# EAGLE design mpx (EAGLE 8.2.1)
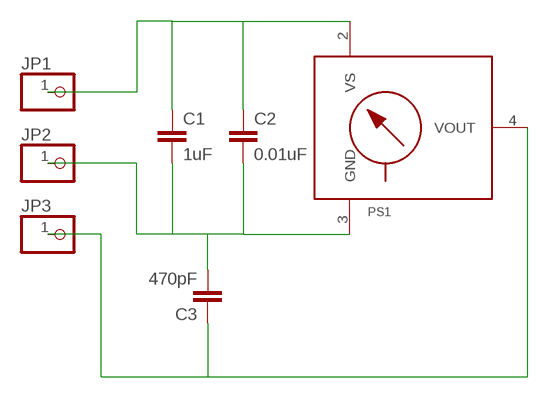
[diagram p0: schematic, sheet 1]

## Parts
C1  1uF  C-EU050-024X044  [C050-024X044]
C2  0.01uF  C-EU050-024X044  [C050-024X044]
C3  470pF  C-EU050-024X044  [C050-024X044]
JP1  PINHD-1X1  [1X01]
JP2  PINHD-1X1  [1X01]
JP3  PINHD-1X1  [1X01]
PS1  MPX-1369  [1369]

## Nets
GND: C1.2 C2.2 C3.2 JP2.1 PS1.3(GND)
N$1: C3.1 JP3.1 PS1.4(VOUT)
N$3: C1.1 C2.1 JP1.1 PS1.2(VS)
Unconnected: PS1.1(NC) PS1.5(NC) PS1.6(NC)

## Library data of the parts
C1-C3 = rcl:C-EU: CAPACITOR, European symbol
JP1-JP3 = pinhead:PINHD-1X1: PIN HEADER
PS1 = mpx-freescale(1):MPX*****: Generic MPX pressure sensor

## Board
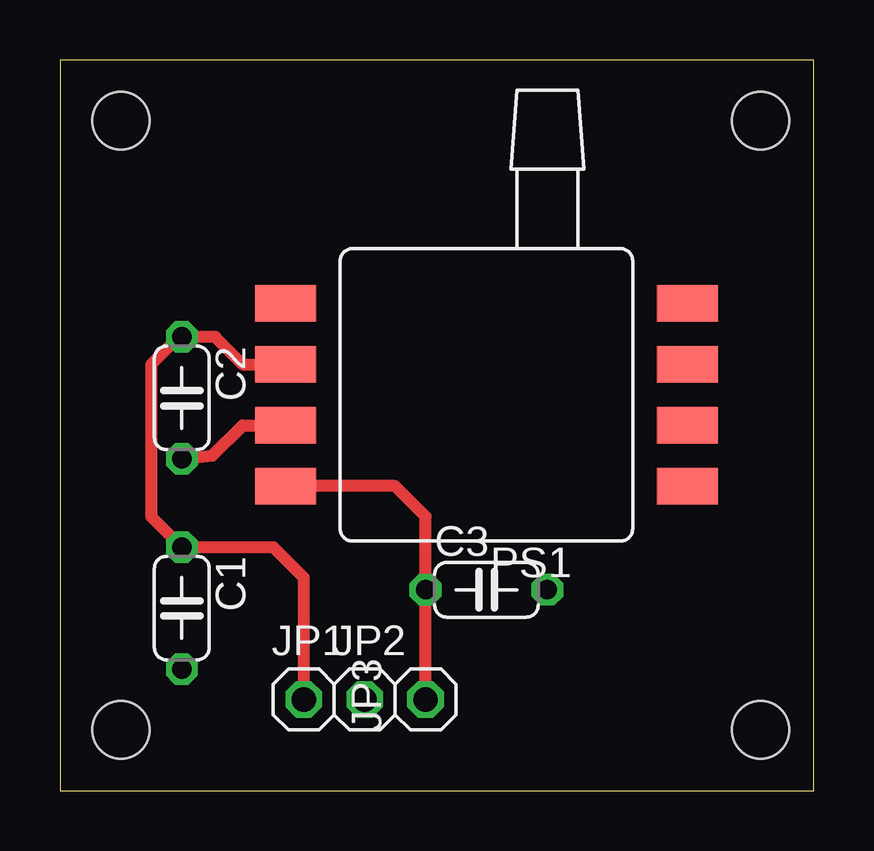
[diagram p1: board, top side]
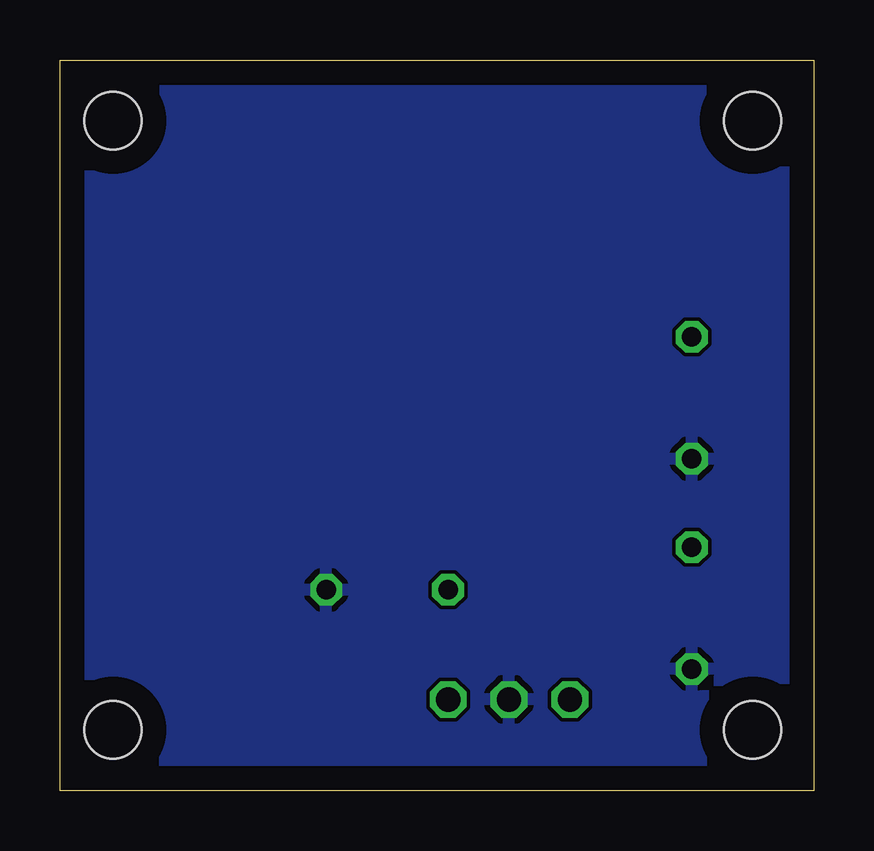
[diagram p2: board, bottom side, seen from below]

Size 31.42 x 30.47 mm. Coordinates in mm from the lower left corner, seen from the top.
Outline: 0,0 31.42,0 31.42,30.47 0,30.47 0,0
Copper layers (1*16): Top 0.035mm / dielectric 1.5mm / Bottom 0.035mm
Design rules "default": minimum track width 6mil, minimum drill 0.35mm, track to track 6mil, track to pad 6mil, pad to pad 6mil, via to via 6mil, smd to smd 6mil, copper to edge 40mil, drill to drill 6mil, minimum pad ring 10mil, minimum via ring 8mil, stop-mask expansion 4mil, vias tented up to drill 0mil, thermal gap 10mil
Holes 2.39 mm at 2.54,2.54 2.54,27.94 29.21,27.94 29.21,2.54

### Footprints (pad centres in the part's own frame; a part is rotated, then mirrored left to right if it is on the bottom)
C050-024X044 = drill 0.813 octagon: 1 -2.54,0; 2 2.54,0
1X01 = drill 1.016 octagon: 1 0,0
1369 = smd 2.54 x 1.524: 1 8.382,-3.81; 2 8.382,-1.27; 3 8.382,1.27; 4 8.382,3.81; 5 -8.382,3.81; 6 -8.382,1.27; 7 -8.382,-1.27; 8 -8.382,-3.81

### Placement (x,y rotation side)
C1  5.08,7.62 270 top
C2  5.08,16.38 270 top
C3  17.78,8.38 0 top
JP1  10.16,3.81 0 top
JP2  12.7,3.81 0 top
JP3  15.24,3.81 90 top
PS1  17.78,16.51 180 top

### Tracks (layer width: path | path; a pad name or v marks a point on that pad's centre or on a via)
GND
  Top 0.508: C2.2 6.35,13.97 7.62,15.24 PS1.3
  pour Bottom: 0,30.48 0,0 31.75,0 31.75,30.48
N$1
  Top 0.508: JP3.1 C3.1 15.24,11.43 13.97,12.7 PS1.4
N$3
  Top 0.508: PS1.2 7.62,17.78 6.48,18.92 C2.1 4.95,18.92 3.81,17.78 3.81,11.43 C1.1 8.89,10.16 10.16,8.89 JP1.1

### Text on the board
tValues: BREATH / SENSOR | Johan Berglund 2017 | Vs | GND | Vout